# Altium schematic sheet v6_config_io_16_17_21_22.SchDoc: Virtex-6 IO Banks 16, 17, 21 & 22
size A3; Date: DO NOT USE, RATHER USE PROJ OPTIONS; DrawnBy: DO NOT USE, RATHER USE PROJ OPTIONS; Engineer: DO NOT USE, RATHER USE PROJ OPTIONS; Organization: DO NOT USE, RATHER USE PROJ OPTIONS; DocumentNumber: DO NOT USE, RATHER USE PROJ OPTIONS; Revision: DO NOT USE, RATHER USE PROJ OPTIONS; SheetNumber: 13; SheetTotal: 27; SCH_Sheet_Filename: v6_config_io_16_17_21_22...; CurrentTime: DO NOT USE, RATHER USE PROJ OPTIONS; Time: DO NOT USE, RATHER USE PROJ OPTIONS; DocumentFullPathAndName: DO NOT USE, RATHER USE PROJ OPTIONS; DocumentName: DO NOT USE, RATHER USE PROJ OPTIONS; ModifiedDate: DO NOT USE, RATHER USE PROJ OPTIONS; ImagePath: DO NOT USE, RATHER USE PROJ OPTIONS
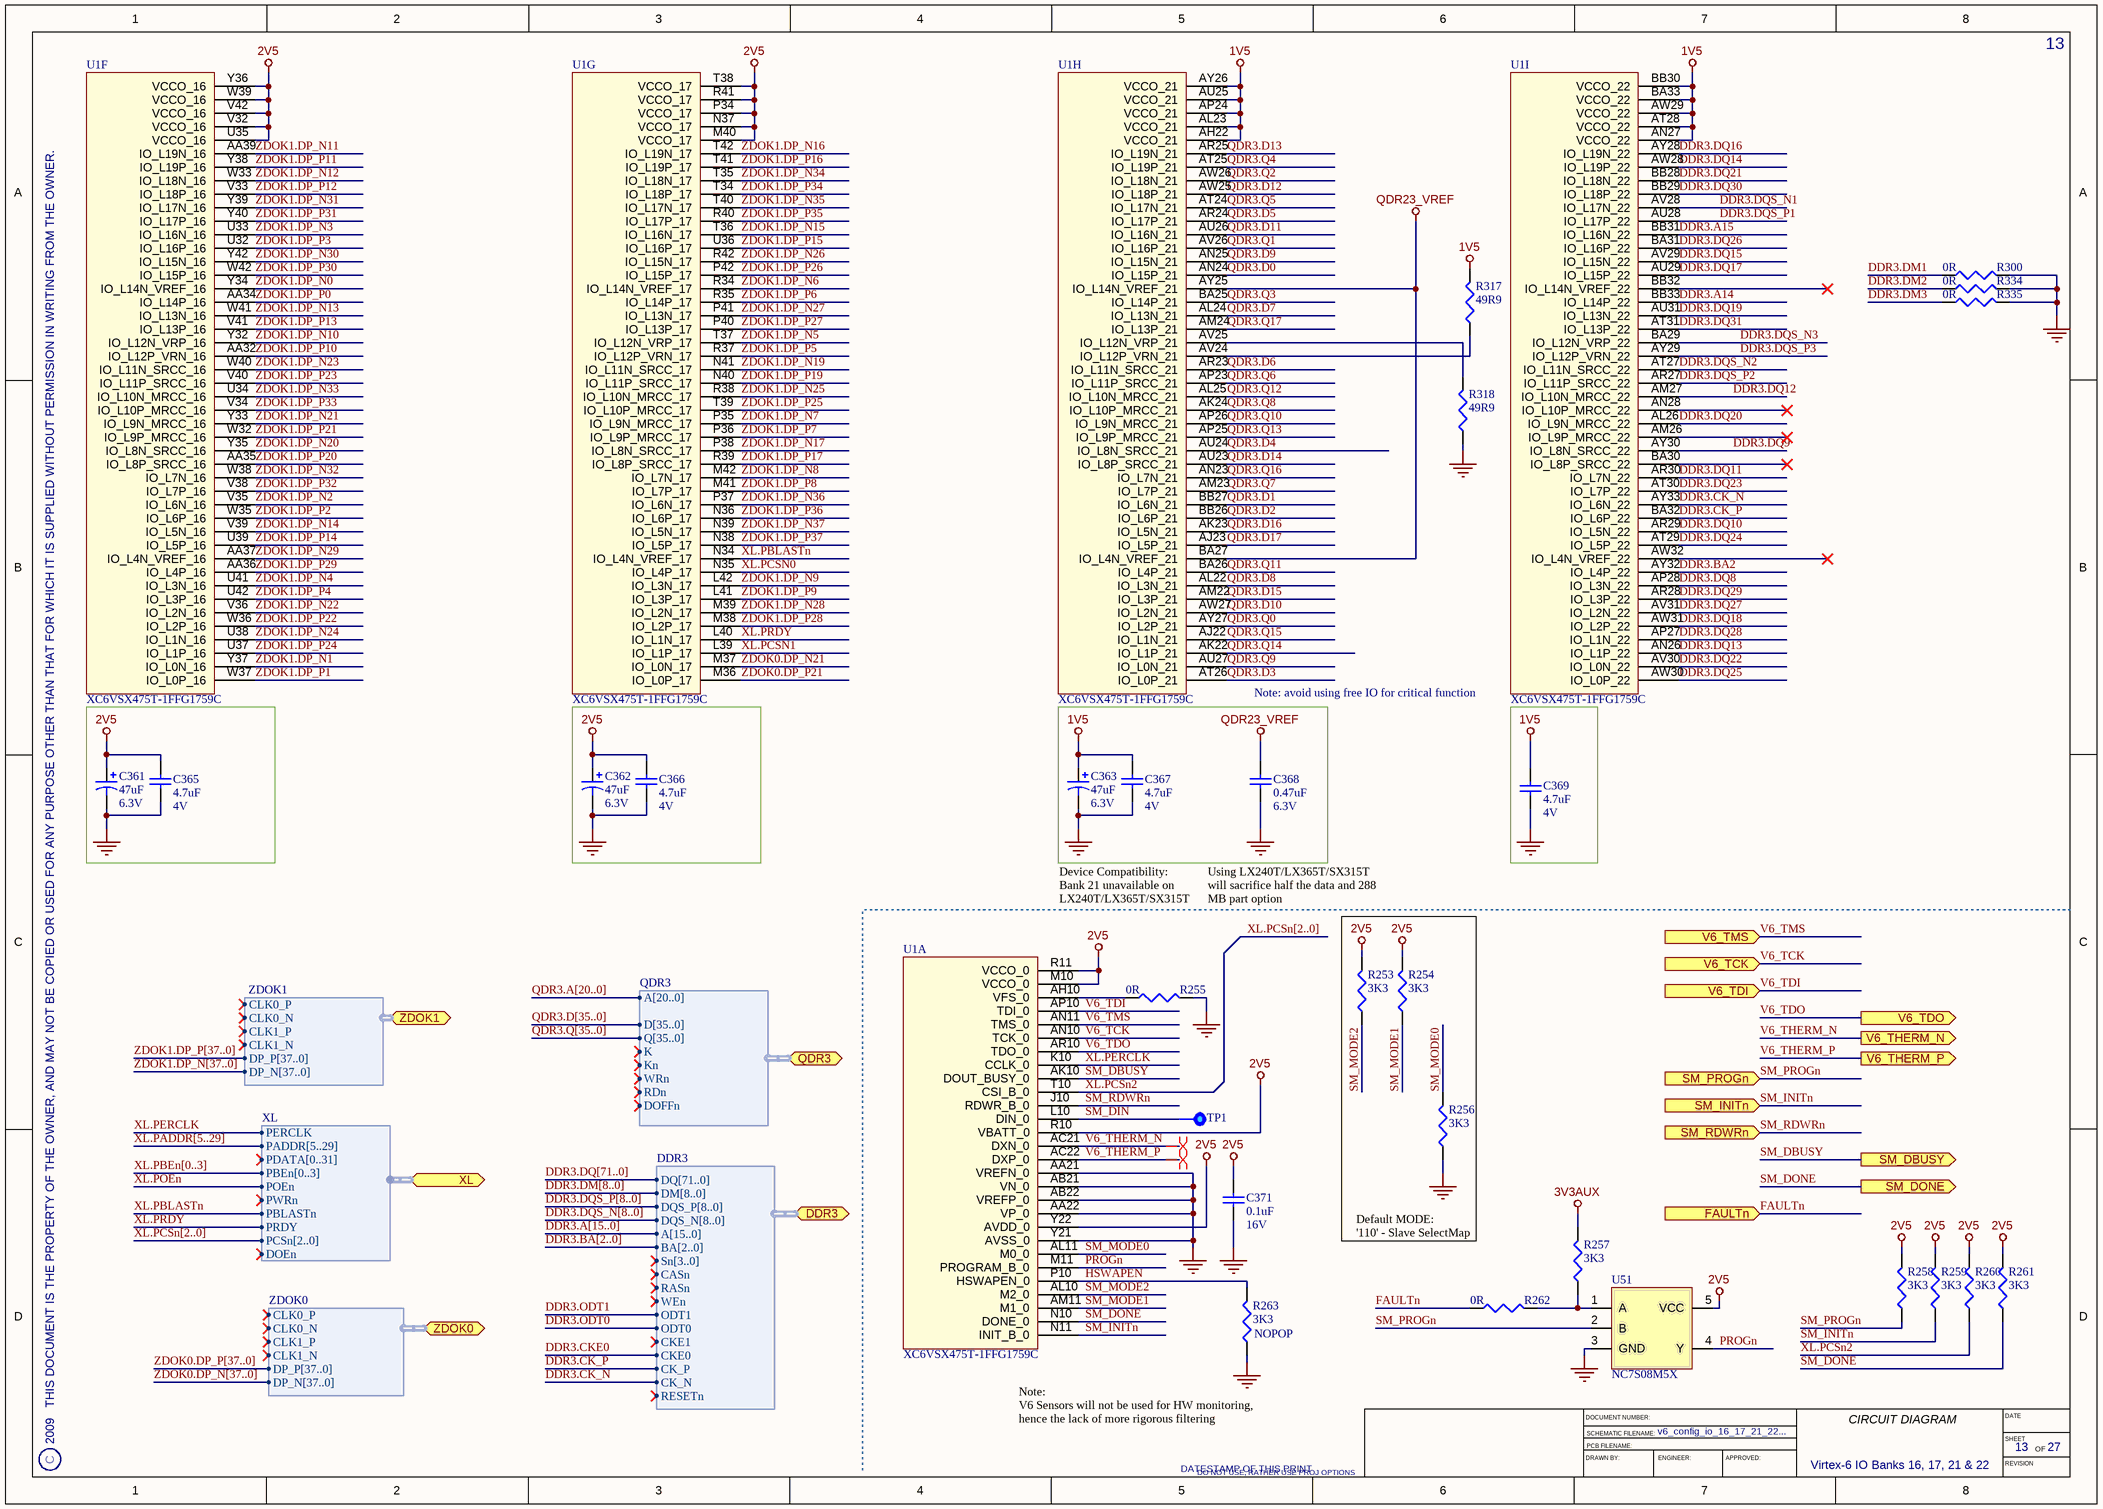
[diagram p0: v6_config_io_16_17_21_22.SchDoc]

## Parts
C361  Rating: 6.3V  [CAPMP3528X120L]  (hidden comment: 47uF)
C362  Rating: 6.3V  [CAPMP3528X120L]  (hidden comment: 47uF)
C363  Rating: 6.3V  [CAPMP3528X120L]  (hidden comment: 47uF)
C365  Rating: 4V  [CAPC1005X60L]  (hidden comment: 4.7uF)
C366  Rating: 4V  [CAPC1005X60L]  (hidden comment: 4.7uF)
C367  Rating: 4V  [CAPC1005X60L]  (hidden comment: 4.7uF)
C368  Rating: 6.3V  [CAPC1005X55L]  (hidden comment: 0.47uF)
C369  Rating: 4V  [CAPC1005X60L]  (hidden comment: 4.7uF)
C371  Rating: 16V  [CAPC1005X60L]  (hidden comment: 0.1uF)
R253  3K3  [RESC1005X40L]
R254  3K3  [RESC1005X40L]
R255  0R  [RESC1005X40L]
R256  3K3  [RESC1005X40L]
R257  3K3  [RESC1005X40L]
R258  3K3  [RESC1005X40L]
R259  3K3  [RESC1005X40L]
R260  3K3  [RESC1005X40L]
R261  3K3  [RESC1005X40L]
R262  0R  [RESC1005X40L]
R263  3K3  [RESC1005X40L]
R300  0R  [RESC1005X40L]
R317  49R9  [RESC1005X40L]
R318  49R9  [RESC1005X40L]
R334  0R  [RESC1005X40L]
R335  0R  [RESC1005X40L]
TP1  Testpoint  [TP100]  (value not drawn)  (no BOM)
U1  XC6VSX475T-1FFG1759C  [FFG1759]  (parts A,F,G,H,I of 39)
U51  NC7S08M5X  [SOT23-5]

## Blocks framed on the sheet
Note: avoid using free IO for critical function: C363 C367 C368

## Ports
DDR3 (harness DDR3), FAULTn (in), QDR3 (harness QDR3), SM_DBUSY (out), SM_DONE (out), SM_INITn (in), SM_PROGn (in), SM_RDWRn (in), V6_TCK (in), V6_TDI (in), V6_TDO (out), V6_THERM_N (out), V6_THERM_P (out), V6_TMS (in), XL (harness XL), ZDOK0 (harness ZDOK0), ZDOK1 (harness ZDOK1)

## Harnesses
ZDOK1: CLK0_P, CLK0_N, CLK1_P, CLK1_N, DP_P[37..0], DP_N[37..0]
QDR3: A[20..0], D[35..0], Q[35..0], K, Kn, WRn, RDn, DOFFn
DDR3: DQ[71..0], DM[8..0], DQS_P[8..0], DQS_N[8..0], A[15..0], BA[2..0], Sn[3..0], CASn, RASn, WEn, ODT1, ODT0, CKE1, CKE0, CK_P, CK_N, RESETn
XL: PERCLK, PADDR[5..29], PDATA[0..31], PBEn[0..3], POEn, PWRn, PBLASTn, PRDY, PCSn[2..0], DOEn
ZDOK0: CLK0_P, CLK0_N, CLK1_P, CLK1_N, DP_P[37..0], DP_N[37..0]

## Nets
1V5: C363.1 C367.2 C369.2 R317.2 U1.AH22(VCCO_21) U1.AL23(VCCO_21) U1.AN27(VCCO_22) U1.AP24(VCCO_21) U1.AT28(VCCO_22) U1.AU25(VCCO_21) U1.AW29(VCCO_22) U1.AY26(VCCO_21) U1.BA33(VCCO_22) U1.BB30(VCCO_22)
2V5: C361.1 C362.1 C365.2 C366.2 C371.2 R253.2 R254.2 R258.2 R259.2 R260.2 R261.2 U1.M10(VCCO_0) U1.M40(VCCO_17) U1.N37(VCCO_17) U1.P34(VCCO_17) U1.R10(VBATT_0) U1.R11(VCCO_0) U1.R41(VCCO_17) U1.T38(VCCO_17) U1.U35(VCCO_16) U1.V32(VCCO_16) U1.V42(VCCO_16) U1.W39(VCCO_16) U1.Y22(AVDD_0) U1.Y36(VCCO_16) U51.5(VCC)
3V3AUX: R257.2
GND: C361.2 C362.2 C363.2 C365.1 C366.1 C367.1 C368.1 C369.1 C371.1 R255.2 R256.1 R263.1 R300.2 R318.1 R334.2 R335.2 U1.AA21(VREFN_0) U1.AA22(VP_0) U1.AB21(VN_0) U1.AB22(VREFP_0) U1.Y21(AVSS_0) U51.3(GND)
QDR23_VREF: C368.2 U1.AY25(IO_L14N_VREF_21) U1.BA27(IO_L4N_VREF_21)
DDR3.A14: U1.BB33(IO_L14P_22)
DDR3.A15: U1.BB31(IO_L16N_22)
DDR3.BA2: U1.AY32(IO_L4P_22)
DDR3.CK_N: U1.AY33(IO_L6N_22) ; port DDR3.CK_N
DDR3.CK_P: U1.BA32(IO_L6P_22) ; port DDR3.CK_P
DDR3.CKE0: port DDR3.CKE0
DDR3.DM1: R300.1
DDR3.DM2: R334.1
DDR3.DM3: R335.1
DDR3.DQ8: U1.AP28(IO_L3N_22)
DDR3.DQ9: U1.AY30(IO_L8N_SRCC_22)
DDR3.DQ10: U1.AR29(IO_L5N_22)
DDR3.DQ11: U1.AR30(IO_L7N_22)
DDR3.DQ12: U1.AM27(IO_L10N_MRCC_22)
DDR3.DQ13: U1.AN26(IO_L1P_22)
DDR3.DQ14: U1.AW28(IO_L19P_22)
DDR3.DQ15: U1.AV29(IO_L15N_22)
DDR3.DQ16: U1.AY28(IO_L19N_22)
DDR3.DQ17: U1.AU29(IO_L15P_22)
DDR3.DQ18: U1.AW31(IO_L2P_22)
DDR3.DQ19: U1.AU31(IO_L13N_22)
DDR3.DQ20: U1.AL26(IO_L9N_MRCC_22)
DDR3.DQ21: U1.BB28(IO_L18N_22)
DDR3.DQ22: U1.AV30(IO_L0N_22)
DDR3.DQ23: U1.AT30(IO_L7P_22)
DDR3.DQ24: U1.AT29(IO_L5P_22)
DDR3.DQ25: U1.AW30(IO_L0P_22)
DDR3.DQ26: U1.BA31(IO_L16P_22)
DDR3.DQ27: U1.AV31(IO_L2N_22)
DDR3.DQ28: U1.AP27(IO_L1N_22)
DDR3.DQ29: U1.AR28(IO_L3P_22)
DDR3.DQ30: U1.BB29(IO_L18P_22)
DDR3.DQ31: U1.AT31(IO_L13P_22)
DDR3.DQS_N1: U1.AV28(IO_L17N_22)
DDR3.DQS_N2: U1.AT27(IO_L11N_SRCC_22)
DDR3.DQS_N3: U1.BA29(IO_L12N_VRP_22)
DDR3.DQS_P1: U1.AU28(IO_L17P_22)
DDR3.DQS_P2: U1.AR27(IO_L11P_SRCC_22)
DDR3.DQS_P3: U1.AY29(IO_L12P_VRN_22)
DDR3.ODT0: port DDR3.ODT0
DDR3.ODT1: port DDR3.ODT1
FAULTn: R262.1 ; port FAULTn
HSWAPEN: R263.2 U1.P10(HSWAPEN_0)
PROGn: U1.M11(PROGRAM_B_0) U51.4(Y)
QDR3.D0: U1.AN24(IO_L15P_21)
QDR3.D1: U1.BB27(IO_L6N_21)
QDR3.D2: U1.BB26(IO_L6P_21)
QDR3.D3: U1.AT26(IO_L0P_21)
QDR3.D4: U1.AU24(IO_L8N_SRCC_21)
QDR3.D5: U1.AR24(IO_L17P_21)
QDR3.D6: U1.AR23(IO_L11N_SRCC_21)
QDR3.D7: U1.AL24(IO_L13N_21)
QDR3.D8: U1.AL22(IO_L3N_21)
QDR3.D9: U1.AN25(IO_L15N_21)
QDR3.D10: U1.AW27(IO_L2N_21)
QDR3.D11: U1.AU26(IO_L16N_21)
QDR3.D12: U1.AW25(IO_L18P_21)
QDR3.D13: U1.AR25(IO_L19N_21)
QDR3.D14: U1.AU23(IO_L8P_SRCC_21)
QDR3.D15: U1.AM22(IO_L3P_21)
QDR3.D16: U1.AK23(IO_L5N_21)
QDR3.D17: U1.AJ23(IO_L5P_21)
QDR3.Q0: U1.AY27(IO_L2P_21)
QDR3.Q1: U1.AV26(IO_L16P_21)
QDR3.Q2: U1.AW26(IO_L18N_21)
QDR3.Q3: U1.BA25(IO_L14P_21)
QDR3.Q4: U1.AT25(IO_L19P_21)
QDR3.Q5: U1.AT24(IO_L17N_21)
QDR3.Q6: U1.AP23(IO_L11P_SRCC_21)
QDR3.Q7: U1.AM23(IO_L7P_21)
QDR3.Q8: U1.AK24(IO_L10P_MRCC_21)
QDR3.Q9: U1.AU27(IO_L0N_21)
QDR3.Q10: U1.AP26(IO_L9N_MRCC_21)
QDR3.Q11: U1.BA26(IO_L4P_21)
QDR3.Q12: U1.AL25(IO_L10N_MRCC_21)
QDR3.Q13: U1.AP25(IO_L9P_MRCC_21)
QDR3.Q14: U1.AK22(IO_L1P_21)
QDR3.Q15: U1.AJ22(IO_L1N_21)
QDR3.Q16: U1.AN23(IO_L7N_21)
QDR3.Q17: U1.AM24(IO_L13P_21)
SM_DBUSY: U1.AK10(DOUT_BUSY_0) ; port SM_DBUSY
SM_DIN: TP1.1 U1.L10(DIN_0)
SM_DONE: R261.1 U1.N10(DONE_0) ; port SM_DONE
SM_INITn: R259.1 U1.N11(INIT_B_0) ; port SM_INITn
SM_MODE0: R256.2 U1.AL11(M0_0)
SM_MODE1: R254.1 U1.AM11(M1_0)
SM_MODE2: R253.1 U1.AL10(M2_0)
SM_PROGn: R258.1 U51.2(B) ; port SM_PROGn
SM_RDWRn: U1.J10(RDWR_B_0) ; port SM_RDWRn
V6_TCK: U1.AN10(TCK_0) ; port V6_TCK
V6_TDI: U1.AP10(TDI_0) ; port V6_TDI
V6_TDO: U1.AR10(TDO_0) ; port V6_TDO
V6_THERM_N: U1.AC21(DXN_0) ; port V6_THERM_N
V6_THERM_P: U1.AC22(DXP_0) ; port V6_THERM_P
V6_TMS: U1.AN11(TMS_0) ; port V6_TMS
XL.PBLASTn: U1.N34(IO_L4N_VREF_17) ; port XL.PBLASTn
XL.PCSN0: U1.N35(IO_L4P_17)
XL.PCSN1: U1.L39(IO_L1P_17)
XL.PCSn2: R260.1 U1.T10(CSI_B_0)
XL.PERCLK: U1.K10(CCLK_0) ; port XL.PERCLK
XL.POEn: port XL.POEn
XL.PRDY: U1.L40(IO_L1N_17) ; port XL.PRDY
ZDOK0.DP_N21: U1.M37(IO_L0N_17)
ZDOK0.DP_P21: U1.M36(IO_L0P_17)
ZDOK1.DP_N0: U1.Y34(IO_L14N_VREF_16)
ZDOK1.DP_N1: U1.Y37(IO_L0N_16)
ZDOK1.DP_N2: U1.V35(IO_L6N_16)
ZDOK1.DP_N3: U1.U33(IO_L16N_16)
ZDOK1.DP_N4: U1.U41(IO_L3N_16)
ZDOK1.DP_N5: U1.T37(IO_L12N_VRP_17)
ZDOK1.DP_N6: U1.R34(IO_L14N_VREF_17)
ZDOK1.DP_N7: U1.P35(IO_L9N_MRCC_17)
ZDOK1.DP_N8: U1.M42(IO_L7N_17)
ZDOK1.DP_N9: U1.L42(IO_L3N_17)
ZDOK1.DP_N10: U1.Y32(IO_L12N_VRP_16)
ZDOK1.DP_N11: U1.AA39(IO_L19N_16)
ZDOK1.DP_N12: U1.W33(IO_L18N_16)
ZDOK1.DP_N13: U1.W41(IO_L13N_16)
ZDOK1.DP_N14: U1.V39(IO_L5N_16)
ZDOK1.DP_N15: U1.T36(IO_L16N_17)
ZDOK1.DP_N16: U1.T42(IO_L19N_17)
ZDOK1.DP_N17: U1.P38(IO_L8N_SRCC_17)
ZDOK1.DP_N19: U1.N41(IO_L11N_SRCC_17)
ZDOK1.DP_N20: U1.Y35(IO_L8N_SRCC_16)
ZDOK1.DP_N21: U1.Y33(IO_L9N_MRCC_16)
ZDOK1.DP_N22: U1.V36(IO_L2N_16)
ZDOK1.DP_N23: U1.W40(IO_L11N_SRCC_16)
ZDOK1.DP_N24: U1.U38(IO_L1N_16)
ZDOK1.DP_N25: U1.R38(IO_L10N_MRCC_17)
ZDOK1.DP_N26: U1.R42(IO_L15N_17)
ZDOK1.DP_N27: U1.P41(IO_L13N_17)
ZDOK1.DP_N28: U1.M39(IO_L2N_17)
ZDOK1.DP_N29: U1.AA37(IO_L4N_VREF_16)
ZDOK1.DP_N30: U1.Y42(IO_L15N_16)
ZDOK1.DP_N31: U1.Y39(IO_L17N_16)
ZDOK1.DP_N32: U1.W38(IO_L7N_16)
ZDOK1.DP_N33: U1.U34(IO_L10N_MRCC_16)
ZDOK1.DP_N34: U1.T35(IO_L18N_17)
ZDOK1.DP_N35: U1.T40(IO_L17N_17)
ZDOK1.DP_N36: U1.P37(IO_L6N_17)
ZDOK1.DP_N37: U1.N39(IO_L5N_17)
ZDOK1.DP_P0: U1.AA34(IO_L14P_16)
ZDOK1.DP_P1: U1.W37(IO_L0P_16)
ZDOK1.DP_P2: U1.W35(IO_L6P_16)
ZDOK1.DP_P3: U1.U32(IO_L16P_16)
ZDOK1.DP_P4: U1.U42(IO_L3P_16)
ZDOK1.DP_P5: U1.R37(IO_L12P_VRN_17)
ZDOK1.DP_P6: U1.R35(IO_L14P_17)
ZDOK1.DP_P7: U1.P36(IO_L9P_MRCC_17)
ZDOK1.DP_P8: U1.M41(IO_L7P_17)
ZDOK1.DP_P9: U1.L41(IO_L3P_17)
ZDOK1.DP_P10: U1.AA32(IO_L12P_VRN_16)
ZDOK1.DP_P11: U1.Y38(IO_L19P_16)
ZDOK1.DP_P12: U1.V33(IO_L18P_16)
ZDOK1.DP_P13: U1.V41(IO_L13P_16)
ZDOK1.DP_P14: U1.U39(IO_L5P_16)
ZDOK1.DP_P15: U1.U36(IO_L16P_17)
ZDOK1.DP_P16: U1.T41(IO_L19P_17)
ZDOK1.DP_P17: U1.R39(IO_L8P_SRCC_17)
ZDOK1.DP_P19: U1.N40(IO_L11P_SRCC_17)
ZDOK1.DP_P20: U1.AA35(IO_L8P_SRCC_16)
ZDOK1.DP_P21: U1.W32(IO_L9P_MRCC_16)
ZDOK1.DP_P22: U1.W36(IO_L2P_16)
ZDOK1.DP_P23: U1.V40(IO_L11P_SRCC_16)
ZDOK1.DP_P24: U1.U37(IO_L1P_16)
ZDOK1.DP_P25: U1.T39(IO_L10P_MRCC_17)
ZDOK1.DP_P26: U1.P42(IO_L15P_17)
ZDOK1.DP_P27: U1.P40(IO_L13P_17)
ZDOK1.DP_P28: U1.M38(IO_L2P_17)
ZDOK1.DP_P29: U1.AA36(IO_L4P_16)
ZDOK1.DP_P30: U1.W42(IO_L15P_16)
ZDOK1.DP_P31: U1.Y40(IO_L17P_16)
ZDOK1.DP_P32: U1.V38(IO_L7P_16)
ZDOK1.DP_P33: U1.V34(IO_L10P_MRCC_16)
ZDOK1.DP_P34: U1.T34(IO_L18P_17)
ZDOK1.DP_P35: U1.R40(IO_L17P_17)
ZDOK1.DP_P36: U1.N36(IO_L6P_17)
ZDOK1.DP_P37: U1.N38(IO_L5P_17)
NetR255_1: R255.1 U1.AH10(VFS_0)
NetR257_1: R257.1 R262.2 U51.1(A)
NetR317_1: R317.1 U1.AV24(IO_L12P_VRN_21)
NetR318_2: R318.2 U1.AV25(IO_L12N_VRP_21)

Not connected (* = marked no-connect by the designer): U1 AM26(IO_L9P_MRCC_22)* AN28(IO_L10P_MRCC_22)* AW32(IO_L4N_VREF_22)* BA30(IO_L8P_SRCC_22)* BB32(IO_L14N_VREF_22)*

## Buses and harness runs
bus DDR3.A[15..0]
bus DDR3.BA[2..0]
bus DDR3.DM[8..0]
bus DDR3.DQ[71..0]
bus DDR3.DQS_N[8..0]
bus DDR3.DQS_P[8..0]
bus QDR3.A[20..0]
bus QDR3.D[35..0]
bus QDR3.Q[35..0]
bus XL.PADDR[5..29]
bus XL.PBEn[0..3]
bus XL.PCSn[2..0]
bus ZDOK0.DP_N[37..0]
bus ZDOK0.DP_P[37..0]
bus ZDOK1.DP_N[37..0]
bus ZDOK1.DP_P[37..0]

## Layout directives
differential pair: V6_THERM_N, V6_THERM_P

## Notes on the sheet
- Device Compatibility:
  Bank 21 unavailable on LX240T/LX365T/SX315T
- Using LX240T/LX365T/SX315T
  will sacrifice half the data and 288
  MB part option
- Default MODE:
  '110' - Slave SelectMap
- (near R263) NOPOP
- Note:
  V6 Sensors will not be used for HW monitoring,
  hence the lack of more rigorous filtering
- 2009   THIS DOCUMENT IS THE PROPERTY OF THE OWNER, AND MAY NOT BE COPIED OR USED FOR ANY PURPOSE OTHER THAN THAT FOR WHICH IT IS SUPPLIED WITHOUT PERMISSION IN WRITING FROM THE OWNER.
- C
- DATESTAMP OF THIS PRINT
- DRAWN BY:
- DOCUMENT NUMBER:
- SCHEMATIC FILENAME:
- PCB FILENAME:
- ENGINEER:
- APPROVED:
- CIRCUIT DIAGRAM
- DATE
- SHEET
- REVISION
- OF

## Library data of the parts
C361-C363 = CAP-TAN-1: 47uF, Conductive Polymer Chip Capacitor; Manufacturer: KEMET; PartNum: T520T476M006ATE070; Tolerance: 20%; ESR: 0.07; POD number: CAP-TAN-1; Value: 47uF; RoHS: Y; Sort Value: 47; Category: Capacitors; Subcategory: Tantalum
C365-C367 C369 = CAP-CER-11: 4.7uF, Ceramic Capacitor; Manufacturer: MURATA; PartNum: AMK105BJ475MV-F; Tolerance: 20%; Dielectric: X5R; POD number: CAP-CER-11; Value: 4.7uF; RoHS: Y; Sort Value: 4.7; Category: Capacitors; Subcategory: Ceramic
C368 = CAP-CER-7: 0.47uF, Ceramic Capacitor; Manufacturer: MURATA; PartNum: GRM155R60J474KE19; Tolerance: 10%; Dielectric: X5R; POD number: CAP-CER-7; Value: 0.47uF; RoHS: Y; Sort Value: 0.47; Category: Capacitors; Subcategory: Ceramic
C371 = CAP-CER-1: 0.1uF, Ceramic Capacitor; Manufacturer: VENKEL; PartNum: C0402X7R160-104KN; Tolerance: 10%; Dielectric: X7R; POD number: CAP-CER-1; Value: 0.1uF; RoHS: Y; Sort Value: 0.1; Category: Capacitors; Subcategory: Ceramic
R253 R254 R256-R261 R263 = RES-TF-7: 3K3, 1.1mm x 0.5mm, Thick Film Resistor; Manufacturer: ROYALOHM; PartNum: 0402WGJ0332T1E; Tolerance: 5%; Rating: 0.0625W; POD number: RES-TF-7; Value: 3K3; Sort Value: 3300; Category: Resistors; Subcategory: ThickFilm; HelpURL: *.pdf
R255 R262 R300 R334 R335 = RES-TF-0: 0R, 1.1mm x 0.5mm, Thick Film Resistor; Manufacturer: ROYALOHM; PartNum: 0402WG00000T1E; Tolerance: 0%; Rating: 0.0625W; POD number: RES-TF-0; Value: 0R; Sort Value: 0; Category: Resistors; Subcategory: ThickFilm; HelpURL: *.pdf
R317 R318 = RES-TF-10: 49R9, 1.1mm x 0.5mm, Thick Film Resistor; Manufacturer: ROYALOHM; PartNum: 0402WGF499JT1E; Tolerance: 1%; Rating: 0.0625W; POD number: RES-TF-10; Value: 49R9; Sort Value: 49.9; Category: Resistors; Subcategory: ThickFilm; HelpURL: *.pdf
TP1 = ELMECH-TP-0: 1mm Diameter, through-hole, Circular Test-point; POD number: ELMECH-TP-0; RoHS: Y; Category: ELMECH; Subcategory: Test Points
U1 = IC-PLD-0: Virtex-6 475SXT 1760-pin FPGA; Manufacturer: Xilinx; POD number: IC-PLD-0; PartNum: XC6VSX475T-1FFG1759C; RoHS: Y; Category: IC; Subcategory: PLD
U51 = IC-LOG-0: TinyLogic® HS 2-Input AND Gate; Manufacturer: Fairchild Semiconductor; POD number: IC-LOG-0; PartNum: NC7S08M5X; RoHS: Y; Category: IC; Subcategory: Logic